# Altium schematic sheet Device_F.SchDoc
size A3; Organization: Altium Limited; Address1: L3, 12a Rodborough Rd; Address2: Frenchs Forest; Address3: NSW; Address4: Australia 2086
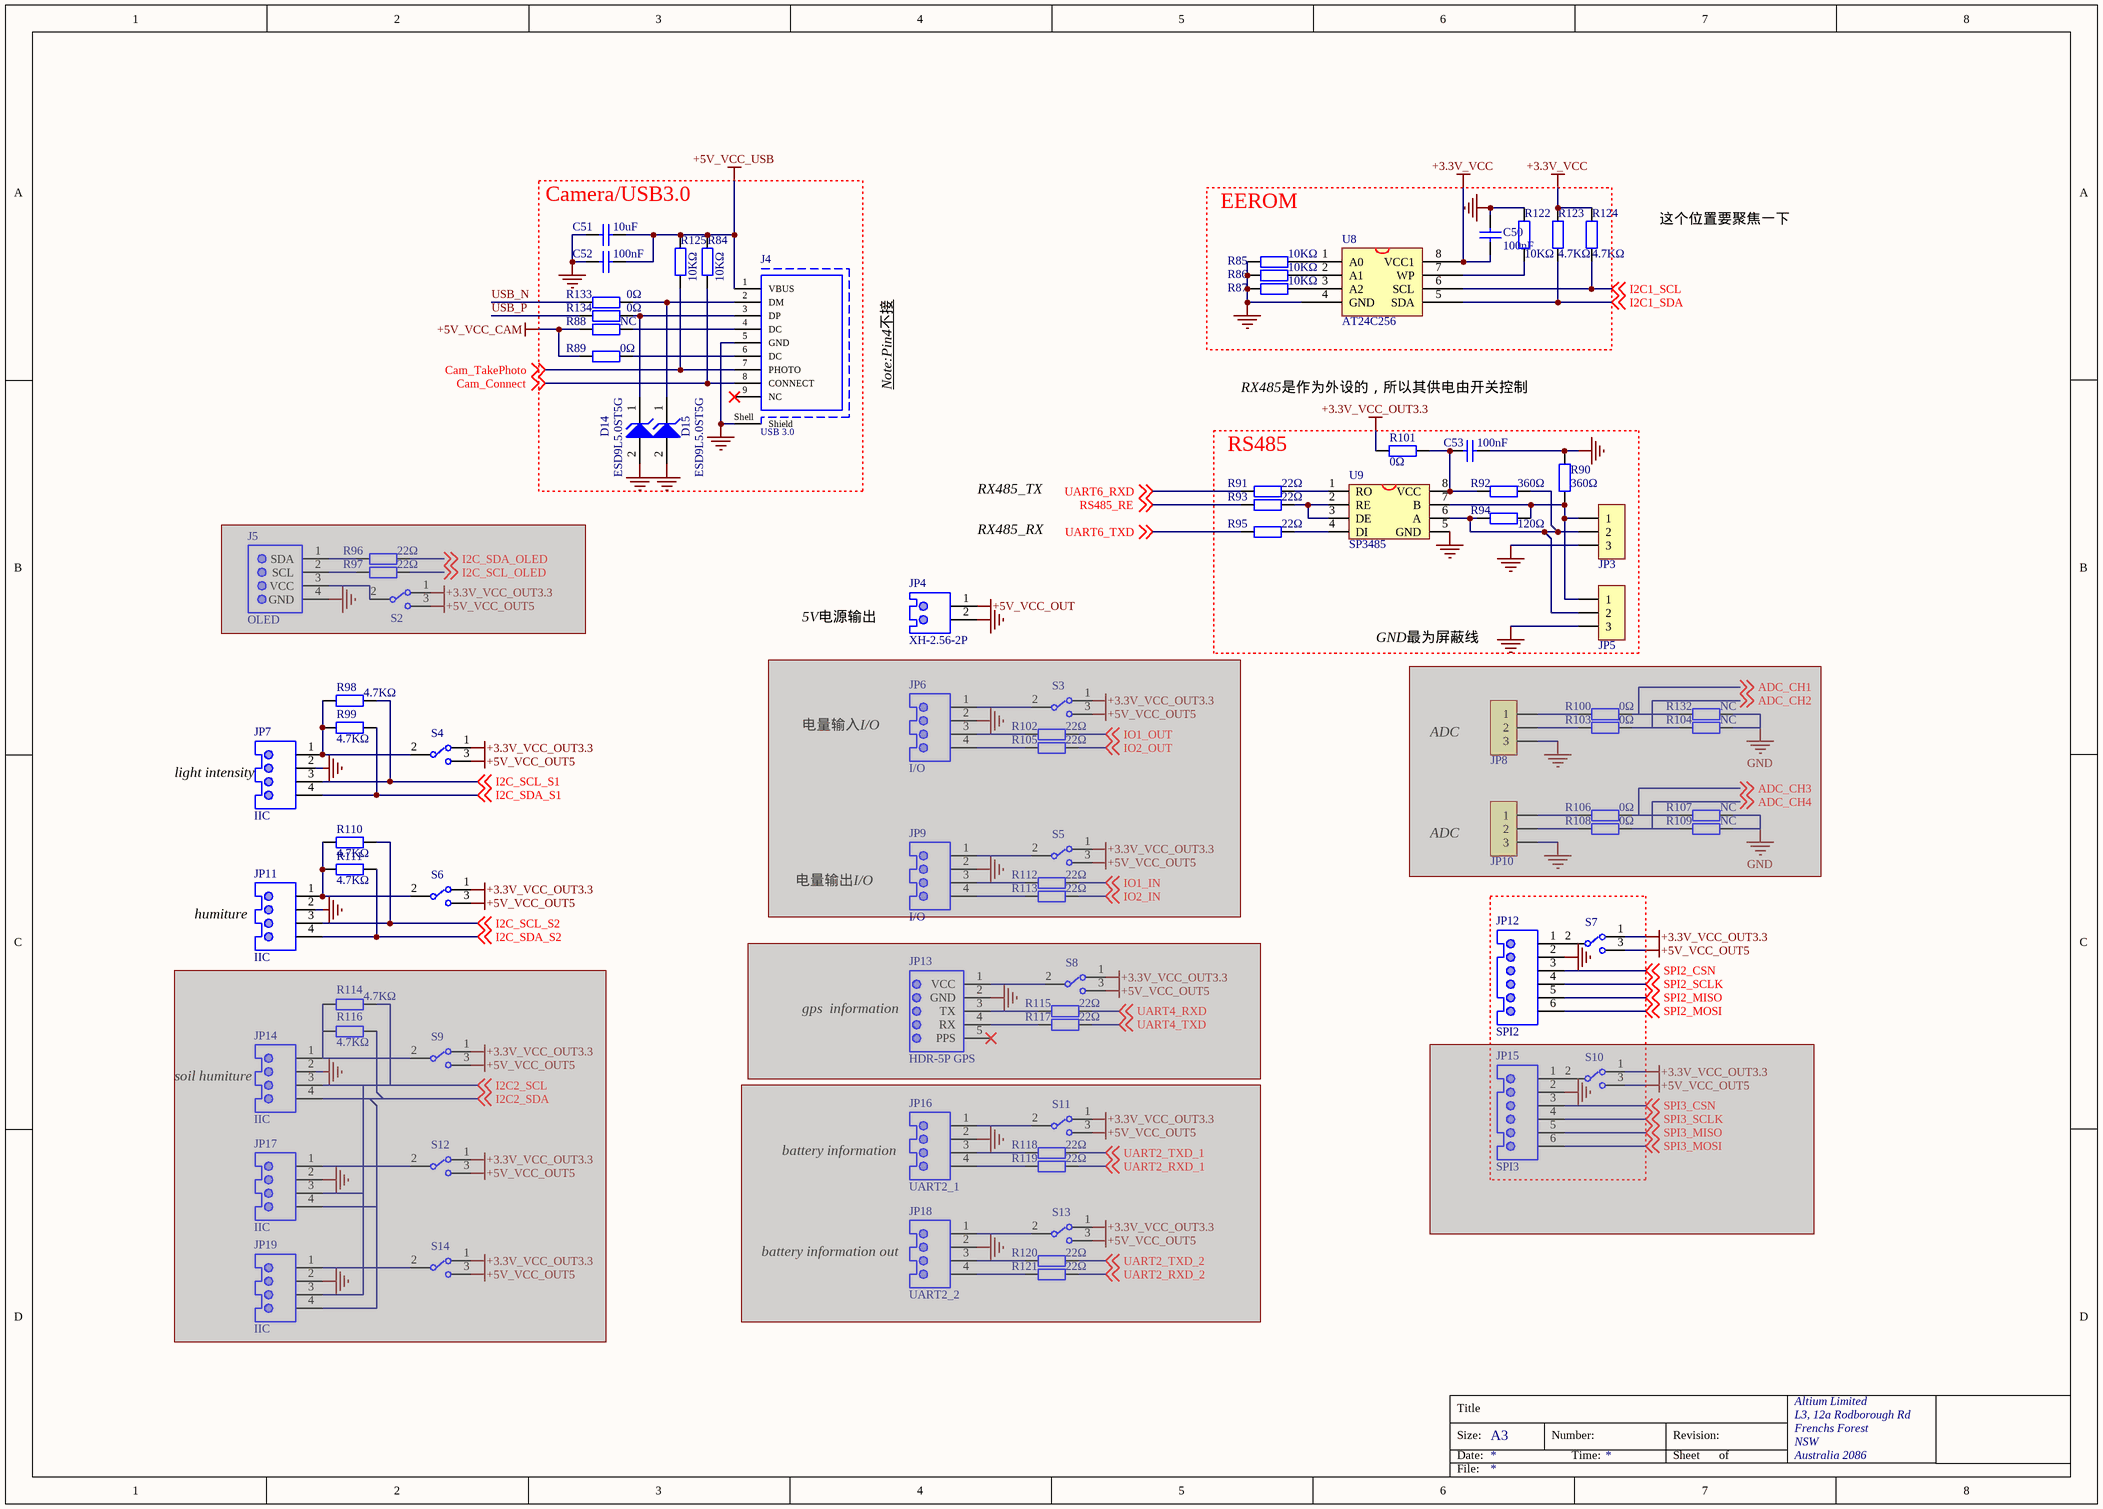
[diagram p0: Device_F.SchDoc]

## Parts
C50  100nF  [0402_C]
C51  10uF  [0805_C]
C52  100nF  [0805_C]
C53  100nF  [0603_C]
D14  ESD9L5.0ST5G  [ONSC-SOD-923-2-514AB-01_V]
D15  ESD9L5.0ST5G  [ONSC-SOD-923-2-514AB-01_V]
J4  USB 3.0  [USB3.0-i]
J5  OLED  [HDR-4P OLED]  (masked out: inside a compile mask, not in the netlist)
JP3  HDR-1X3  [KF350-3P]  (value not drawn)
JP4  XH-2.56-2P  [XH2.54-2P]
JP5  HDR-1X3  [KF350-3P]  (value not drawn)
JP6  I/O  [XH2.54-4P]  (masked out: inside a compile mask, not in the netlist)
JP7  IIC  [XH2.54-4P]
JP8  HDR-1X3  [HDR-1X3]  (value not drawn)  (masked out: inside a compile mask, not in the netlist)
JP9  I/O  [XH2.54-4P]  (masked out: inside a compile mask, not in the netlist)
JP10  HDR-1X3  [HDR-1X3]  (value not drawn)  (masked out: inside a compile mask, not in the netlist)
JP11  IIC  [XH2.54-4P]
JP12  SPI2  [XH2.54-6P]
JP13  HDR-5P GPS  [HDR-5P GPS]  (masked out: inside a compile mask, not in the netlist)
JP14  IIC  [XH2.54-4P]  (masked out: inside a compile mask, not in the netlist)
JP15  SPI3  [XH2.54-6P]  (masked out: inside a compile mask, not in the netlist)
JP16  UART2_1  [XH2.54-4P]  (masked out: inside a compile mask, not in the netlist)
JP17  IIC  [XH2.54-4P]  (masked out: inside a compile mask, not in the netlist)
JP18  UART2_2  [XH2.54-4P]  (masked out: inside a compile mask, not in the netlist)
JP19  IIC  [XH2.54-4P]  (masked out: inside a compile mask, not in the netlist)
R84  10KΩ  [0402_R]
R85  10KΩ  [0402_R]
R86  10KΩ  [0402_R]
R87  10KΩ  [0402_R]
R88  NC  [0603_R]
R89  0Ω  [0603_R]
R90  360Ω  [0402_R]
R91  22Ω  [0402_R]
R92  360Ω  [0402_R]
R93  22Ω  [0402_R]
R94  120Ω  [0402_R]
R95  22Ω  [0402_R]
R96  22Ω  [0402_R]  (masked out: inside a compile mask, not in the netlist)
R97  22Ω  [0402_R]  (masked out: inside a compile mask, not in the netlist)
R98  4.7KΩ  [0402_R]
R99  4.7KΩ  [0402_R]
R100  0Ω  [0402_R]  (masked out: inside a compile mask, not in the netlist)
R101  0Ω  [0402_R]
R102  22Ω  [0402_R]  (masked out: inside a compile mask, not in the netlist)
R103  0Ω  [0402_R]  (masked out: inside a compile mask, not in the netlist)
R104  NC  [0402_R]  (masked out: inside a compile mask, not in the netlist)
R105  22Ω  [0402_R]  (masked out: inside a compile mask, not in the netlist)
R106  0Ω  [0402_R]  (masked out: inside a compile mask, not in the netlist)
R107  NC  [0402_R]  (masked out: inside a compile mask, not in the netlist)
R108  0Ω  [0402_R]  (masked out: inside a compile mask, not in the netlist)
R109  NC  [0402_R]  (masked out: inside a compile mask, not in the netlist)
R110  4.7KΩ  [0402_R]
R111  4.7KΩ  [0402_R]
R112  22Ω  [0402_R]  (masked out: inside a compile mask, not in the netlist)
R113  22Ω  [0402_R]  (masked out: inside a compile mask, not in the netlist)
R114  4.7KΩ  [0402_R]  (masked out: inside a compile mask, not in the netlist)
R115  22Ω  [0402_R]  (masked out: inside a compile mask, not in the netlist)
R116  4.7KΩ  [0402_R]  (masked out: inside a compile mask, not in the netlist)
R117  22Ω  [0402_R]  (masked out: inside a compile mask, not in the netlist)
R118  22Ω  [0402_R]  (masked out: inside a compile mask, not in the netlist)
R119  22Ω  [0402_R]  (masked out: inside a compile mask, not in the netlist)
R120  22Ω  [0402_R]  (masked out: inside a compile mask, not in the netlist)
R121  22Ω  [0402_R]  (masked out: inside a compile mask, not in the netlist)
R122  10KΩ  [0402_R]
R123  4.7KΩ  [0402_R]
R124  4.7KΩ  [0402_R]
R125  10KΩ  [0402_R]
R132  NC  [0402_R]  (masked out: inside a compile mask, not in the netlist)
R133  0Ω  [0402_R]
R134  0Ω  [0402_R]
S2  SW  [SWITCH_SPOT]  (value not drawn)  (masked out: inside a compile mask, not in the netlist)
S3  SW  [SWITCH_SPOT]  (value not drawn)  (masked out: inside a compile mask, not in the netlist)
S4  SW  [SWITCH_SPOT]  (value not drawn)
S5  SW  [SWITCH_SPOT]  (value not drawn)  (masked out: inside a compile mask, not in the netlist)
S6  SW  [SWITCH_SPOT]  (value not drawn)
S7  SW  [SWITCH_SPOT]  (value not drawn)
S8  SW  [SWITCH_SPOT]  (value not drawn)  (masked out: inside a compile mask, not in the netlist)
S9  SW  [SWITCH_SPOT]  (value not drawn)  (masked out: inside a compile mask, not in the netlist)
S10  SW  [SWITCH_SPOT]  (value not drawn)  (masked out: inside a compile mask, not in the netlist)
S11  SW  [SWITCH_SPOT]  (value not drawn)  (masked out: inside a compile mask, not in the netlist)
S12  SW  [SWITCH_SPOT]  (value not drawn)  (masked out: inside a compile mask, not in the netlist)
S13  SW  [SWITCH_SPOT]  (value not drawn)  (masked out: inside a compile mask, not in the netlist)
S14  SW  [SWITCH_SPOT]  (value not drawn)  (masked out: inside a compile mask, not in the netlist)
U8  AT24C256  [SOP-8_150mil]
U9  SP3485  [SOP-8_150mil]

## Blocks framed on the sheet
Camera/USB3.0: C51 C52 D14 D15 J4 R84 R88 R89 R125 R133 R134
EEROM: C50 R85-R87 R122-R124 U8
RS485: C53 JP3 JP5 R90-R95 R101 U9

## Nets
+3.3V_VCC: C50.1 R123.1 R124.1 U8.8(VCC1)
+3.3V_VCC_OUT3.3: R101.1 S4.1 S6.1 S7.1
+5V_VCC_CAM: R88.1 R89.1
+5V_VCC_OUT: JP4.1
+5V_VCC_OUT5: S4.3 S6.3 S7.3
+5V_VCC_USB: C51.2 C52.2 J4.1(VBUS) R84.2 R125.2
GND: C50.2 C51.1 C52.1 C53.2 D14.2(A) D15.2(A) J4.5(GND) J4.Shell(Shield) JP3.3 JP4.2 JP5.3 JP7.2 JP11.2 JP12.2 R85.2 R86.2 R87.2 R90.2 R122.1 U8.4(GND) U9.5(GND)
Cam_Connect: J4.8(CONNECT) R84.1 ; off-sheet Cam_Connect
Cam_TakePhoto: J4.7(PHOTO) R125.1 ; off-sheet Cam_TakePhoto
I2C1_SCL: R124.2 U8.6(SCL) ; off-sheet I2C1_SCL
I2C1_SDA: R123.2 U8.5(SDA) ; off-sheet I2C1_SDA
I2C_SCL_S1: JP7.3 R98.2 ; off-sheet I2C_SCL_S1
I2C_SCL_S2: JP11.3 R110.2 ; off-sheet I2C_SCL_S2
I2C_SDA_S1: JP7.4 R99.2 ; off-sheet I2C_SDA_S1
I2C_SDA_S2: JP11.4 R111.2 ; off-sheet I2C_SDA_S2
RS485_RE: R93.1 ; off-sheet RS485_RE
SPI2_CSN: JP12.3 ; off-sheet SPI2_CSN
SPI2_MISO: JP12.5 ; off-sheet SPI2_MISO
SPI2_MOSI: JP12.6 ; off-sheet SPI2_MOSI
SPI2_SCLK: JP12.4 ; off-sheet SPI2_SCLK
UART6_RXD: R91.1 ; off-sheet UART6_RXD
UART6_TXD: R95.1 ; off-sheet UART6_TXD
USB_N: R133.1
USB_P: R134.1
NetC53_1: C53.1 R92.2 R101.2 U9.8(VCC)
NetD14_1: D14.1(K) J4.3(DP) R134.2
NetD15_1: D15.1(K) J4.2(DM) R133.2
NetJ4_4: J4.4(DC) R88.2
NetJ4_6: J4.6(DC) R89.2
NetJP3_1: JP3.1 JP5.1 R90.1 R94.1 U9.7(B)
NetJP3_2: JP3.2 JP5.2 R92.1 R94.2 U9.6(A)
NetJP7_1: JP7.1 R98.1 R99.1 S4.2
NetJP11_1: JP11.1 R110.1 R111.1 S6.2
NetJP12_1: JP12.1 S7.2
NetR85_1: R85.1 U8.1(A0)
NetR86_1: R86.1 U8.2(A1)
NetR87_1: R87.1 U8.3(A2)
NetR91_2: R91.2 U9.1(RO)
NetR93_2: R93.2 U9.2(RE) U9.3(DE)
NetR95_2: R95.2 U9.4(DI)
NetR122_2: R122.2 U8.7(WP)

Not connected (* = marked no-connect by the designer): J4 9(NC)*

## Notes on the sheet
- 这个位置要聚焦一下
- Note:Pin4不接
- RX485是作为外设的，所以其供电由开关控制
- RX485_TX
- RX485_RX
- 5V电源输出
- GND最为屏蔽线
- (near JP7) light intensity
- 电量输入I/O
- ADC
- (near JP11) humiture
- 电量输出I/O
- (near JP13) gps  information
- (near JP14) soil humiture
- (near JP16) battery information
- (near JP18) battery information out
- Title
- Size:
- Date:
- A3
- Number:
- Time:
- Revision:
- Sheet
- of
- File:
- *

## Library data of the parts
C50 = Cap 0402 100nF (104) 10% 16V: 贴片电容; ComponentLink1Description: 供应商链接; ComponentLink1URL: http://www.szlcsc.com/product/details_1877.html; Package: 0402; Supplier: LC; SuppliersPartNumber: C1525
C51 = Cap 0805 10uF (106) 10% 25V: 贴片电容; ComponentLink1Description: 供应商链接; ComponentLink1URL: http://www.szlcsc.com/product/details_16532.html; Package: 0805; Supplier: LC; SuppliersPartNumber: C15850; Value: 10uF
C52 = Cap 0805 100nF(104) 10% 50V: 贴片电容; ComponentLink1Description: 供应商链接; ComponentLink1URL: http://www.szlcsc.com/product/details_50686.html; Package: 0805; Supplier: LC; SuppliersPartNumber: C49678; Value: 100nF
C53 = Cap 0603 100nF (104) 10% 50V: 贴片电容; ComponentLink1Description: 供应商链接; ComponentLink1URL: http://www.szlcsc.com/product/details_15331.html; Package: 0603; Supplier: LC; SuppliersPartNumber: C14663
D14 D15 = SOD-923 ESD9L5.0ST5G: Transient Voltage Suppressor, ESD Protection Diode with Ultra-Low Capacitance, 2-Pin SOD-923, Pb-Free, Tape and Reel, CMP-1063-00114-1; Manufacturer: On Semiconductor; IR Max (uA): 1; VRWM Max (V): 5; V(BR) Min (V): 5.4; C Max (pF): 0.9; Direction: Unidirectional; RoHS: Pb-Free; Packing: Tape and Reel; Mounting Technology: Surface Mount; ComponentLink3Description: Package Specification; PackageDescription: 2-Pin SOD, Body 0.8 x 0.6 mm; ComponentLink2Description: Datasheet; PackageReference: SOD-923-2-514AB-01; PartNumber: ESD9L5.0ST5G; ComponentLink1Description: Manufacturer URL; PackageVersion: Rev. C, 03/2011; Number of Lines: 1; ComponentLink3URL: http://www.onsemi.com/pub_link/Collateral/514AB.PDF; DatasheetVersion: Rev. 5; ComponentLink2URL: http://www.onsemi.cn/pub_link/Collateral/ESD9L-D.PDF; ComponentLink1URL: http://www.onsemi.com/
J4 = USB 3.0 Type A: USB 3.0 Type A Receptacle WR-COM, Horizontal, THT; Part Number: 692121030100; Manufacturer: Wurth Elektronik; Contact Resistance: 50mOhm; Working Voltage: 30VAC; Rated Current: 0.25A; Orientation: Horizontal; Publisher: WurthElektronik; Gender: Receptacle; Mounting Technology: THT; Datasheet URL: https://katalog.we-online.de/em/datasheet/692121030100.pdf; Package Reference: 692121030100; Operating Temperature: -20to85degC; Packaging: TapeandReel; Manufacturer URL: http://www.we-online.de; Connector Type: USB3.0TypeA
J5 = HDR-4P OLED 0.91: Header, 4-Pin; LatestRevisionDate: 17-Jul-2002; LatestRevisionNote: Re-released for DXP Platform.; Publisher: Altium Limited
JP3 JP5 JP8 JP10 = Header HDR-1X3: 3P接插件; 版权归属: 源创客; BOM名称: 3P接插件; 学习资源: www.ooocke.com
JP4 = Header XH-2.56-2P: Male Header, Pitch 2.5 mm, 1 x 2 Position, Height 7 mm, Tail Length 3.4 mm, -25 to 85 degC, RoHS, Bulk; Manufacturer: JST; No of Positions: 2; Pitch: 2.5mm; Style/Orientation: StraightHeader/Plug; Datasheet Version: 05/2016; Package Description: Male Header, Pitch 2.5 mm, 1 x 2 Position, Height 7 mm, Tail Length 3.4 mm; Package Reference: B2B-XH-A; Mounting Technology: ThroughHole; Type: ShroudedHeader; Datasheet URL: http://www.jst-mfg.com/product/pdf/eng/eXH.pdf; Manufacturer URL: http://www.jst.com/home2.html; Termination: Crimp
JP6 JP7 JP9 JP11 JP14 JP16-JP19 = Header XH-2.56-4P: Male Header, Pitch 2.5 mm, 1 x 4 Position, Height 7 mm, Tail Length 8.4 mm, -25 to 85 degC, RoHS, Bulk; Manufacturer: JST; No of Positions: 2; Pitch: 2.5mm; Style/Orientation: StraightHeader/Plug; Datasheet Version: 05/2016; Package Description: Male Header, Pitch 2.5 mm, 1 x 2 Position, Height 7 mm, Tail Length 3.4 mm; Package Reference: B2B-XH-A; Mounting Technology: ThroughHole; Type: ShroudedHeader; Datasheet URL: http://www.jst-mfg.com/product/pdf/eng/eXH.pdf; Manufacturer URL: http://www.jst.com/home2.html; Termination: Crimp
JP12 JP15 = Header XH-2.56-6P: Male Header, Pitch 2.5 mm, 1 x 4 Position, Height 7 mm, Tail Length 8.4 mm, -25 to 85 degC, RoHS, Bulk; Manufacturer: JST; No of Positions: 2; Pitch: 2.5mm; Style/Orientation: StraightHeader/Plug; Datasheet Version: 05/2016; Package Description: Male Header, Pitch 2.5 mm, 1 x 2 Position, Height 7 mm, Tail Length 3.4 mm; Package Reference: B2B-XH-A; Mounting Technology: ThroughHole; Type: ShroudedHeader; Datasheet URL: http://www.jst-mfg.com/product/pdf/eng/eXH.pdf; Manufacturer URL: http://www.jst.com/home2.html; Termination: Crimp
JP13 = HDR-5P GPS: Header, 5-Pin; LatestRevisionDate: 17-Jul-2002; LatestRevisionNote: Re-released for DXP Platform.; Publisher: Altium Limited
R84-R87 R122 R125 = Res 0402 10KΩ (1002) 1%: 贴片电阻; ComponentLink1Description: 供应商链接; ComponentLink1URL: http://www.szlcsc.com/product/details_26487.html; Package: 0402; Supplier: LC; SuppliersPartNumber: C25744; Value: 10KΩ
R88 R89 = Res 0603 0Ω (0R0) 1%: 贴片电阻; ComponentLink1Description: 供应商链接; ComponentLink1URL: http://www.szlcsc.com/product/details_21903.html; Package: 0603; Supplier: LC; SuppliersPartNumber: C21189
R90 R92 = Res 0402 360Ω (3600) 1%: 贴片电阻; ComponentLink1Description: 供应商链接; ComponentLink1URL: http://www.szlcsc.com/product/details_25822.html; Package: 0402; Supplier: LC; SuppliersPartNumber: C25079
R91 R93 R95-R97 R102 R105 R112 R113 R115 R117-R121 = Res 0402 22Ω (22R0) 1%: 贴片电阻; ComponentLink1Description: 供应商链接; ComponentLink1URL: http://www.szlcsc.com/product/details_25835.html; Package: 0402; Supplier: LC; SuppliersPartNumber: C25092; Value: 22Ω
R94 = Res 0402 120Ω (1200) 1%: 贴片电阻; ComponentLink1Description: 供应商链接; ComponentLink1URL: http://www.szlcsc.com/product/details_25822.html; Package: 0402; Supplier: LC; SuppliersPartNumber: C25079
R98 R99 R110 R111 R114 R116 R123 R124 = Res 0402 4.7KΩ (4701) 1%: 贴片电阻; ComponentLink1Description: 供应商链接; ComponentLink1URL: http://www.szlcsc.com/product/details_26643.html; Package: 0402; Supplier: LC; SuppliersPartNumber: C25900; Value: 4.7KΩ
R100 R101 R103 R106 R108 R133 R134 = Res 0402 0Ω (0R0) 1%: 贴片电阻; ComponentLink1Description: 供应商链接; ComponentLink1URL: http://www.szlcsc.com/product/details_17853.html; Package: 0402; Supplier: LC; SuppliersPartNumber: C17168; Value: 0Ω
R104 R107 R109 R132 = Res 0402 0Ω (0R0) 1%: 贴片电阻; Value: 0Ω; ComponentLink1Description: 供应商链接; ComponentLink1URL: http://www.szlcsc.com/product/details_17853.html; Package: 0402; Supplier: LC; SuppliersPartNumber: C17168
S2-S14 = SW SPOT_SW-1P: 1路开关; BOM名称: 波动开关; 版权归属: 源创客; 学习资源: www.ooocke.com
U8 = AT24C256: EEROM
U9 = MAX3485